# Altium schematic sheet SensorHumedad.SchDoc
size A4
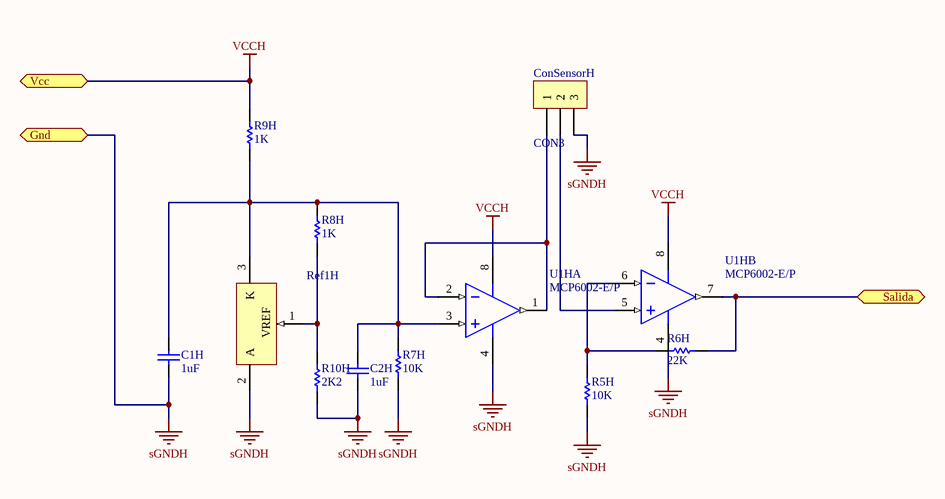
[diagram p0: SensorHumedad.SchDoc]

## Parts
C1H  1uF  [CAPPOL100]
C2H  1uF  [CAPPOL100]
ConSensorH  CON3  [BORNERA3 - T]
R5H  10K  [RES300]
R6H  22K  [RES300]
R7H  10K  [RES300]
R8H  1K  [RES300]
R9H  1K  [RES300]
R10H  2K2  [RES300]
Ref1H  TL431ACLP  [LP03]  (value not drawn)
U1H  MCP6002-E/P  [DIP8B]  (parts A,B of 2)

## Ports
Gnd, Salida, Vcc

## Nets
sGNDH: C1H.1 C2H.1 ConSensorH.3 R5H.1 R7H.1 R10H.1 Ref1H.2(A) U1H.4(VSS) ; port Gnd
VCCH: R9H.2 U1H.8(VDD) ; port Vcc
Salida: R6H.1 U1H.7(VOUTB) ; port Salida
NetC1H_2: C1H.2 C2H.2 R7H.2 R8H.2 R9H.1 Ref1H.3(K) U1H.3(VINA+)
NetConSensorH_1: ConSensorH.1 U1H.1(VOUTA) U1H.2(VINA-)
NetConSensorH_2: ConSensorH.2 U1H.5(VINB+)
NetR5H_2: R5H.2 R6H.2 U1H.6(VINB-)
NetR8H_1: R8H.1 R10H.2 Ref1H.1(VREF)

## Library data of the parts
C1H C2H = CAP: Capacitor
ConSensorH = CON3: Conector 3
R5H R6H R7H R8H R9H R10H = RES: Resistencia
Ref1H = TL431ACLP: Adjustable Precision Shunt Regulator; Published: 15-Apr-2002; LatestRevisionDate: 06-Jun-2005; LatestRevisionNote: Sch pins 1 & 3 swapped; DatasheetVersion: Oct-2000; PackageVersion: Nov-2001; PackageReference: LP03; Publisher: Altium Limited; PackageDescription: TO, Flat Index; 3 In-Line, Axial Leads; Body Dia. 4.8mm; Leads 0.56 x 0.41 mm (max); Code_JEDEC: TO-226-AA; ComponentLink1Description: Manufacturer Link; ComponentLink1URL: http://www.ti.com/; ComponentLink2Description: Datasheet; ComponentLink2URL: http://www-s.ti.com/sc/ds/tl431a.pdf
U1H = MCP6002-E/P: 1 MHz, Low-Power Operational Amplifier, 8-Pin PDIP, Extended Temperature; Published: 29-Jan-2009; LatestRevisionDate: 02-Dec-2009; LatestRevisionNote: Updated to datasheet revision J, Nov-2009; DatasheetVersion: revJ, Nov-2009; PackageVersion: revBB, Aug-2009; PackageReference: PDIP300-P8; Publisher: Altium Limited; PackageDescription: 8-Lead Plastic Dual In-Line (P) - 300 mil Body [PDIP]; Supplier 1: Digi-Key; Supplier Part Number 1: MCP6002-E/P-ND; Supplier 2: Farnell; Supplier Part Number 2: 1332117; Code_JEDEC: MS-001; ComponentLink1Description: Datasheet; ComponentLink1URL: http://ww1.microchip.com/downloads/en/DeviceDoc/21733j.pdf; ComponentLink2Description: Packaging Specification; ComponentLink2URL: http://www.microchip.com/stellent/groups/techpub_sg/documents/packagingspec/en012702.pdf; ComponentLink3Description: Microchip.com Home; ComponentLink3URL: http://www.microchip.com/